# Altium schematic sheet MSXII_steeringWheelSchematic.SchDoc: Steering Wheel Board
size Letter; Organization: Midnight Sun Solar Rayce Car Team; Address1: University of Waterloo; Address2: 200 University Ave W; Address3: Waterloo, ON, Canada; Address4: N2L 3E9; Revision: 1.6; SheetNumber: 1; SheetTotal: 1; Website: www.uwmidsun.com
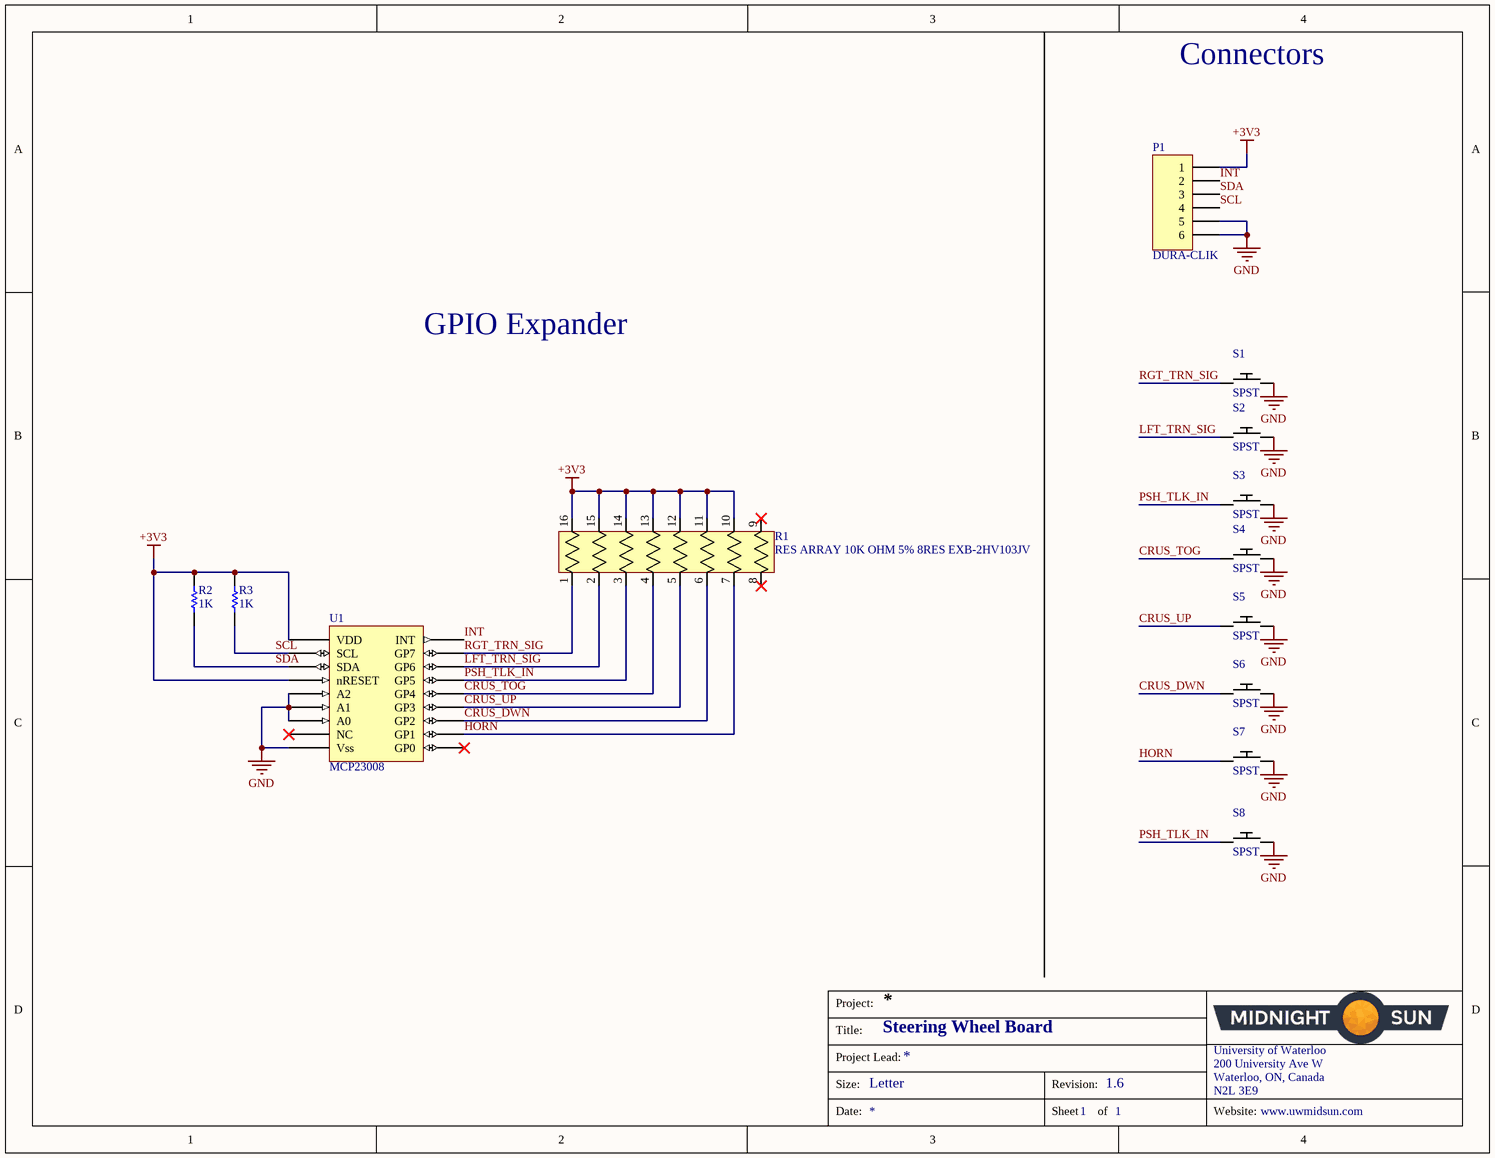
[diagram p0: MSXII_steeringWheelSchematic.SchDoc]

## Parts
P1  DURA-CLIK  [CONN, 6POS DURA-CLIK VERT]
R1  RES ARRAY 10K OHM 5% 8RES EXB-2HV103JV  [RES ARRAY, 8 POS 1506]
R2  1K  [RES, 0603]
R3  1K  [RES, 0603]
S1  SPST  [SW SPST-NO 6x6mm Via Hole]
S2  SPST  [SW SPST-NO 6x6mm Via Hole]
S3  SPST  [SW SPST-NO 6x6mm Via Hole]
S4  SPST  [SW SPST-NO 6x6mm Via Hole]
S5  SPST  [SW SPST-NO 6x6mm Via Hole]
S6  SPST  [SW SPST-NO 6x6mm Via Hole]
S7  SPST  [SW SPST-NO 6x6mm Via Hole]
S8  SPST  [SW SPST-NO 6x6mm Via Hole]
U1  MCP23008  [IC 18SOIC]

## Nets
+3V3: P1.1 R1.10 R1.11 R1.12 R1.13 R1.14 R1.15 R1.16 R2.1 R3.1 U1.6(nRESET) U1.18(VDD)
GND: P1.5 P1.6 S1.2 S2.2 S3.2 S4.2 S5.2 S6.2 S7.2 S8.2 U1.3(A2) U1.4(A1) U1.5(A0) U1.9(Vss)
CRUS_DWN: R1.6 S6.1 U1.12(GP2)
CRUS_TOG: R1.4 S4.1 U1.14(GP4)
CRUS_UP: R1.5 S5.1 U1.13(GP3)
HORN: R1.7 S7.1 U1.11(GP1)
INT: P1.2 U1.8(INT)
LFT_TRN_SIG: R1.2 S2.1 U1.16(GP6)
PSH_TLK_IN: R1.3 S3.1 S8.1 U1.15(GP5)
RGT_TRN_SIG: R1.1 S1.1 U1.17(GP7)
SCL: P1.4 R3.2 U1.1(SCL)
SDA: P1.3 R2.2 U1.2(SDA)

Not connected (* = marked no-connect by the designer): R1 8* 9*; U1 7(NC)* 10(GP0)*

## Notes on the sheet
- Connectors
- GPIO Expander
- Project:
- Title:
- Size:
- Project Lead:
- Letter
- Revision:
- University of Waterloo
- 200 University Ave W
- Waterloo, ON, Canada
- N2L 3E9
- Date:
- Sheet
- of
- Website:

## Library data of the parts
P1 = CONN 6POS DURA-CLIK 0.079": 6 Positions Header, Shrouded Connector 0.079" (2.00mm) Surface Mount, Vertical Tin; Manufacturer: Molex; Manufacturer Part Number: 5600200820; Supplier 1: Digi-Key; Supplier Part Number 1: WM10866CT-ND
R1 = RES ARRAY 10K OHM 5% 8RES EXB-2HV103JV: RES ARRAY SMD 10K 5% 62.5mW 1506; Vendor: Panasonic; C: Copyright (C) 2015 Accelerated Designs. All rights reserved; Value: Value; Copyright: Copyright (C) 2015 Accelerated Designs. All rights reserved; Manufacturer_Part_Number: EXB-2HV103JV; Supplier 1: Digi-Key; Supplier Part Number 1: Y1103CT-ND
R2 R3 = RES 1K OHM 5% 1/10W 0603: 1k Ohm ±5% 0.1W, 1/10W Chip Resistor 0603 (1608 Metric); Supplier 1: Digi-Key; Supplier Part Number 1: 311-1.0KGRCT-ND
S1-S8 = SW SPST-NO 15VDC@0.02A via hole: Switch Tactile SPST 6x6x9.5mm 15VDC@0.02A Through Hole; Supplier 1: Digi-Key; Supplier Part Number 1: P8012S-ND
U1 = IC I/O EXPANDER I2C 8B 18SOIC: MCP23008 I/O Expander 8B+1Int 18P SOIC; Supplier 1: Digi-Key; Supplier Part Number 1: MCP23008T-E/SOCT-ND